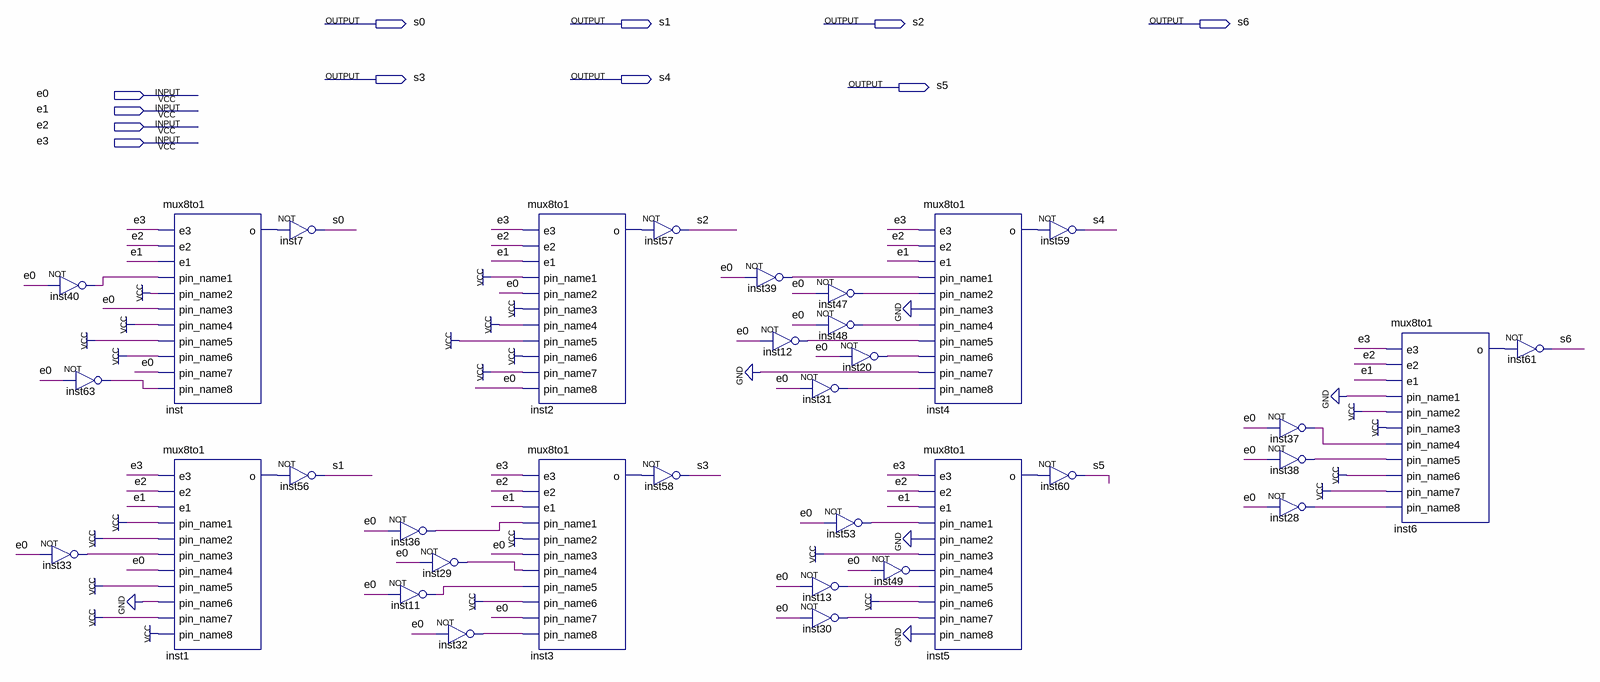
[diagram p0: schematic sheet]
// Quartus schematic display7.bdf as structural Verilog: 34 symbols, 11 pins
module display7 (
  input  e0,
  input  e1,
  input  e2,
  input  e3,
  output s0,
  output s1,
  output s2,
  output s6,
  output s3,
  output s4,
  output s5
);

  wire inst1_o, inst2_o, inst3_o, inst4_o, inst5_o, inst6_o, inst11_out, inst12_out, inst13_out, inst20_out,
       inst28_out, inst29_out, inst30_out, inst31_out, inst32_out, inst33_out, inst36_out, inst37_out,
       inst38_out, inst39_out, inst40_out, inst47_out, inst48_out, inst49_out, inst53_out, inst63_out, inst_o;

  not inst40 (inst40_out, e0);
  not inst63 (inst63_out, e0);
  not inst33 (inst33_out, e0);
  mux8to1 inst (
    .e3(e3), .e2(e2), .e1(e1), .pin_name1(inst40_out), .pin_name2(1'b1), .pin_name3(e0), .pin_name4(1'b1),
    .pin_name5(1'b1), .pin_name6(1'b1), .pin_name7(e0), .pin_name8(inst63_out), .o(inst_o));
  mux8to1 inst1 (
    .e3(e3), .e2(e2), .e1(e1), .pin_name1(1'b1), .pin_name2(1'b1), .pin_name3(inst33_out), .pin_name4(e0),
    .pin_name5(1'b1), .pin_name6(1'b0), .pin_name7(1'b1), .pin_name8(1'b1), .o(inst1_o));
  not inst7 (s0, inst_o);
  not inst56 (s1, inst1_o);
  not inst36 (inst36_out, e0);
  not inst29 (inst29_out, e0);
  not inst11 (inst11_out, e0);
  not inst32 (inst32_out, e0);
  mux8to1 inst2 (
    .e3(e3), .e2(e2), .e1(e1), .pin_name1(1'b1), .pin_name2(e0), .pin_name3(1'b1), .pin_name4(1'b1),
    .pin_name5(1'b1), .pin_name6(1'b1), .pin_name7(1'b1), .pin_name8(e0), .o(inst2_o));
  mux8to1 inst3 (
    .e3(e3), .e2(e2), .e1(e1), .pin_name1(inst36_out), .pin_name2(1'b1), .pin_name3(e0),
    .pin_name4(inst29_out), .pin_name5(inst11_out), .pin_name6(1'b1), .pin_name7(e0), .pin_name8(inst32_out),
    .o(inst3_o));
  not inst57 (s2, inst2_o);
  not inst58 (s3, inst3_o);
  not inst39 (inst39_out, e0);
  not inst12 (inst12_out, e0);
  not inst47 (inst47_out, e0);
  not inst48 (inst48_out, e0);
  not inst31 (inst31_out, e0);
  not inst53 (inst53_out, e0);
  not inst13 (inst13_out, e0);
  not inst30 (inst30_out, e0);
  not inst20 (inst20_out, e0);
  not inst49 (inst49_out, e0);
  mux8to1 inst4 (
    .e3(e3), .e2(e2), .e1(e1), .pin_name1(inst39_out), .pin_name2(inst47_out), .pin_name3(1'b0),
    .pin_name4(inst48_out), .pin_name5(inst12_out), .pin_name6(inst20_out), .pin_name7(1'b0),
    .pin_name8(inst31_out), .o(inst4_o));
  mux8to1 inst5 (
    .e3(e3), .e2(e2), .e1(e1), .pin_name1(inst53_out), .pin_name2(1'b0), .pin_name3(1'b1),
    .pin_name4(inst49_out), .pin_name5(inst13_out), .pin_name6(1'b1), .pin_name7(inst30_out),
    .pin_name8(1'b0), .o(inst5_o));
  not inst59 (s4, inst4_o);
  not inst60 (s5, inst5_o);
  not inst37 (inst37_out, e0);
  not inst38 (inst38_out, e0);
  not inst28 (inst28_out, e0);
  mux8to1 inst6 (
    .e3(e3), .e2(e2), .e1(e1), .pin_name1(1'b0), .pin_name2(1'b1), .pin_name3(1'b1), .pin_name4(inst37_out),
    .pin_name5(inst38_out), .pin_name6(1'b1), .pin_name7(1'b1), .pin_name8(inst28_out), .o(inst6_o));
  not inst61 (s6, inst6_o);
endmodule
